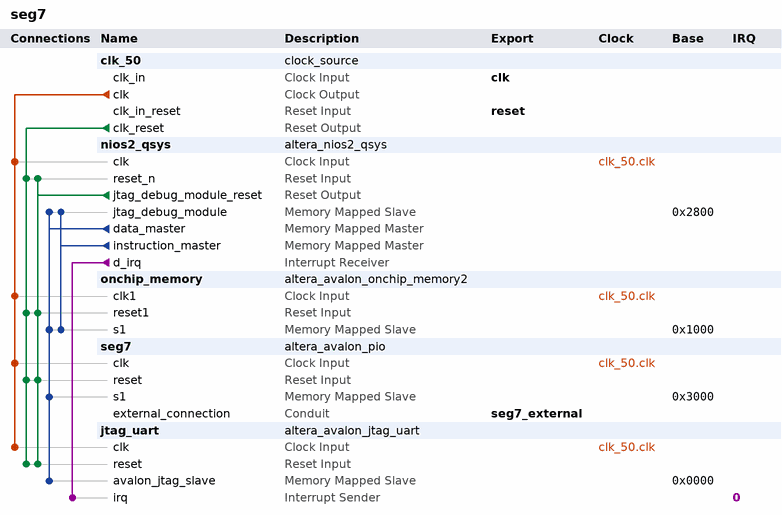
[diagram p0: system contents]
# Platform Designer (Qsys) system seg7, Cyclone IV E EP4CE115F29C7
# Parameters at their usual value, and those the tool derives, are not listed.
package require -exact qsys 13.0.1
create_system seg7
set_project_property DEVICE_FAMILY {Cyclone IV E}
set_project_property DEVICE EP4CE115F29C7

add_instance clk_50 clock_source 13.0
set_instance_parameter_value clk_50 clockFrequency 50000000

add_instance nios2_qsys altera_nios2_qsys 13.0
set_instance_parameter_value nios2_qsys resetSlave onchip_memory.s1
set_instance_parameter_value nios2_qsys mmu_TLBMissExcSlave None
set_instance_parameter_value nios2_qsys exceptionSlave onchip_memory.s1
set_instance_parameter_value nios2_qsys breakSlave nios2_qsys.jtag_debug_module
set_instance_parameter_value nios2_qsys impl Tiny
set_instance_parameter_value nios2_qsys icache_size 4096

add_instance onchip_memory altera_avalon_onchip_memory2 13.0.1
set_instance_parameter_value onchip_memory dataWidth 32
set_instance_parameter_value onchip_memory dualPort false
set_instance_parameter_value onchip_memory initMemContent true
set_instance_parameter_value onchip_memory initializationFileName onchip_mem.hex
set_instance_parameter_value onchip_memory memorySize 4096

add_instance seg7 altera_avalon_pio 13.0.1
set_instance_parameter_value seg7 direction Output
set_instance_parameter_value seg7 width 7

add_instance jtag_uart altera_avalon_jtag_uart 13.0.1
set_instance_parameter_value jtag_uart simInteractiveOptions NO_INTERACTIVE_WINDOWS

# connections
add_connection clk_50.clk jtag_uart.clk clock
add_connection clk_50.clk nios2_qsys.clk clock
add_connection clk_50.clk onchip_memory.clk1 clock
add_connection clk_50.clk seg7.clk clock
add_connection clk_50.clk_reset jtag_uart.reset reset
add_connection clk_50.clk_reset nios2_qsys.reset_n reset
add_connection clk_50.clk_reset onchip_memory.reset1 reset
add_connection clk_50.clk_reset seg7.reset reset
add_connection nios2_qsys.jtag_debug_module_reset jtag_uart.reset reset
add_connection nios2_qsys.jtag_debug_module_reset nios2_qsys.reset_n reset
add_connection nios2_qsys.jtag_debug_module_reset onchip_memory.reset1 reset
add_connection nios2_qsys.jtag_debug_module_reset seg7.reset reset
add_connection nios2_qsys.data_master jtag_uart.avalon_jtag_slave avalon
set_connection_parameter_value nios2_qsys.data_master/jtag_uart.avalon_jtag_slave baseAddress 0x0000
add_connection nios2_qsys.data_master nios2_qsys.jtag_debug_module avalon
set_connection_parameter_value nios2_qsys.data_master/nios2_qsys.jtag_debug_module baseAddress 0x2800
add_connection nios2_qsys.data_master onchip_memory.s1 avalon
set_connection_parameter_value nios2_qsys.data_master/onchip_memory.s1 baseAddress 0x1000
add_connection nios2_qsys.data_master seg7.s1 avalon
set_connection_parameter_value nios2_qsys.data_master/seg7.s1 baseAddress 0x3000
add_connection nios2_qsys.instruction_master nios2_qsys.jtag_debug_module avalon
set_connection_parameter_value nios2_qsys.instruction_master/nios2_qsys.jtag_debug_module baseAddress 0x2800
add_connection nios2_qsys.instruction_master onchip_memory.s1 avalon
set_connection_parameter_value nios2_qsys.instruction_master/onchip_memory.s1 baseAddress 0x1000
add_connection nios2_qsys.d_irq jtag_uart.irq interrupt
set_connection_parameter_value nios2_qsys.d_irq/jtag_uart.irq irqNumber 0

# exported interfaces
add_interface clk clock sink
set_interface_property clk EXPORT_OF clk_50.clk_in
add_interface reset reset sink
set_interface_property reset EXPORT_OF clk_50.clk_in_reset
add_interface seg7_external conduit end
set_interface_property seg7_external EXPORT_OF seg7.external_connection

set_interconnect_requirement {$system} qsys_mm.clockCrossingAdapter HANDSHAKE
set_interconnect_requirement {$system} qsys_mm.maxAdditionalLatency 1

save_system seg7.qsys
